# EAGLE schematic DIN41612_Backplane (EAGLE 9.6.2)

## Sheet 1 of 2
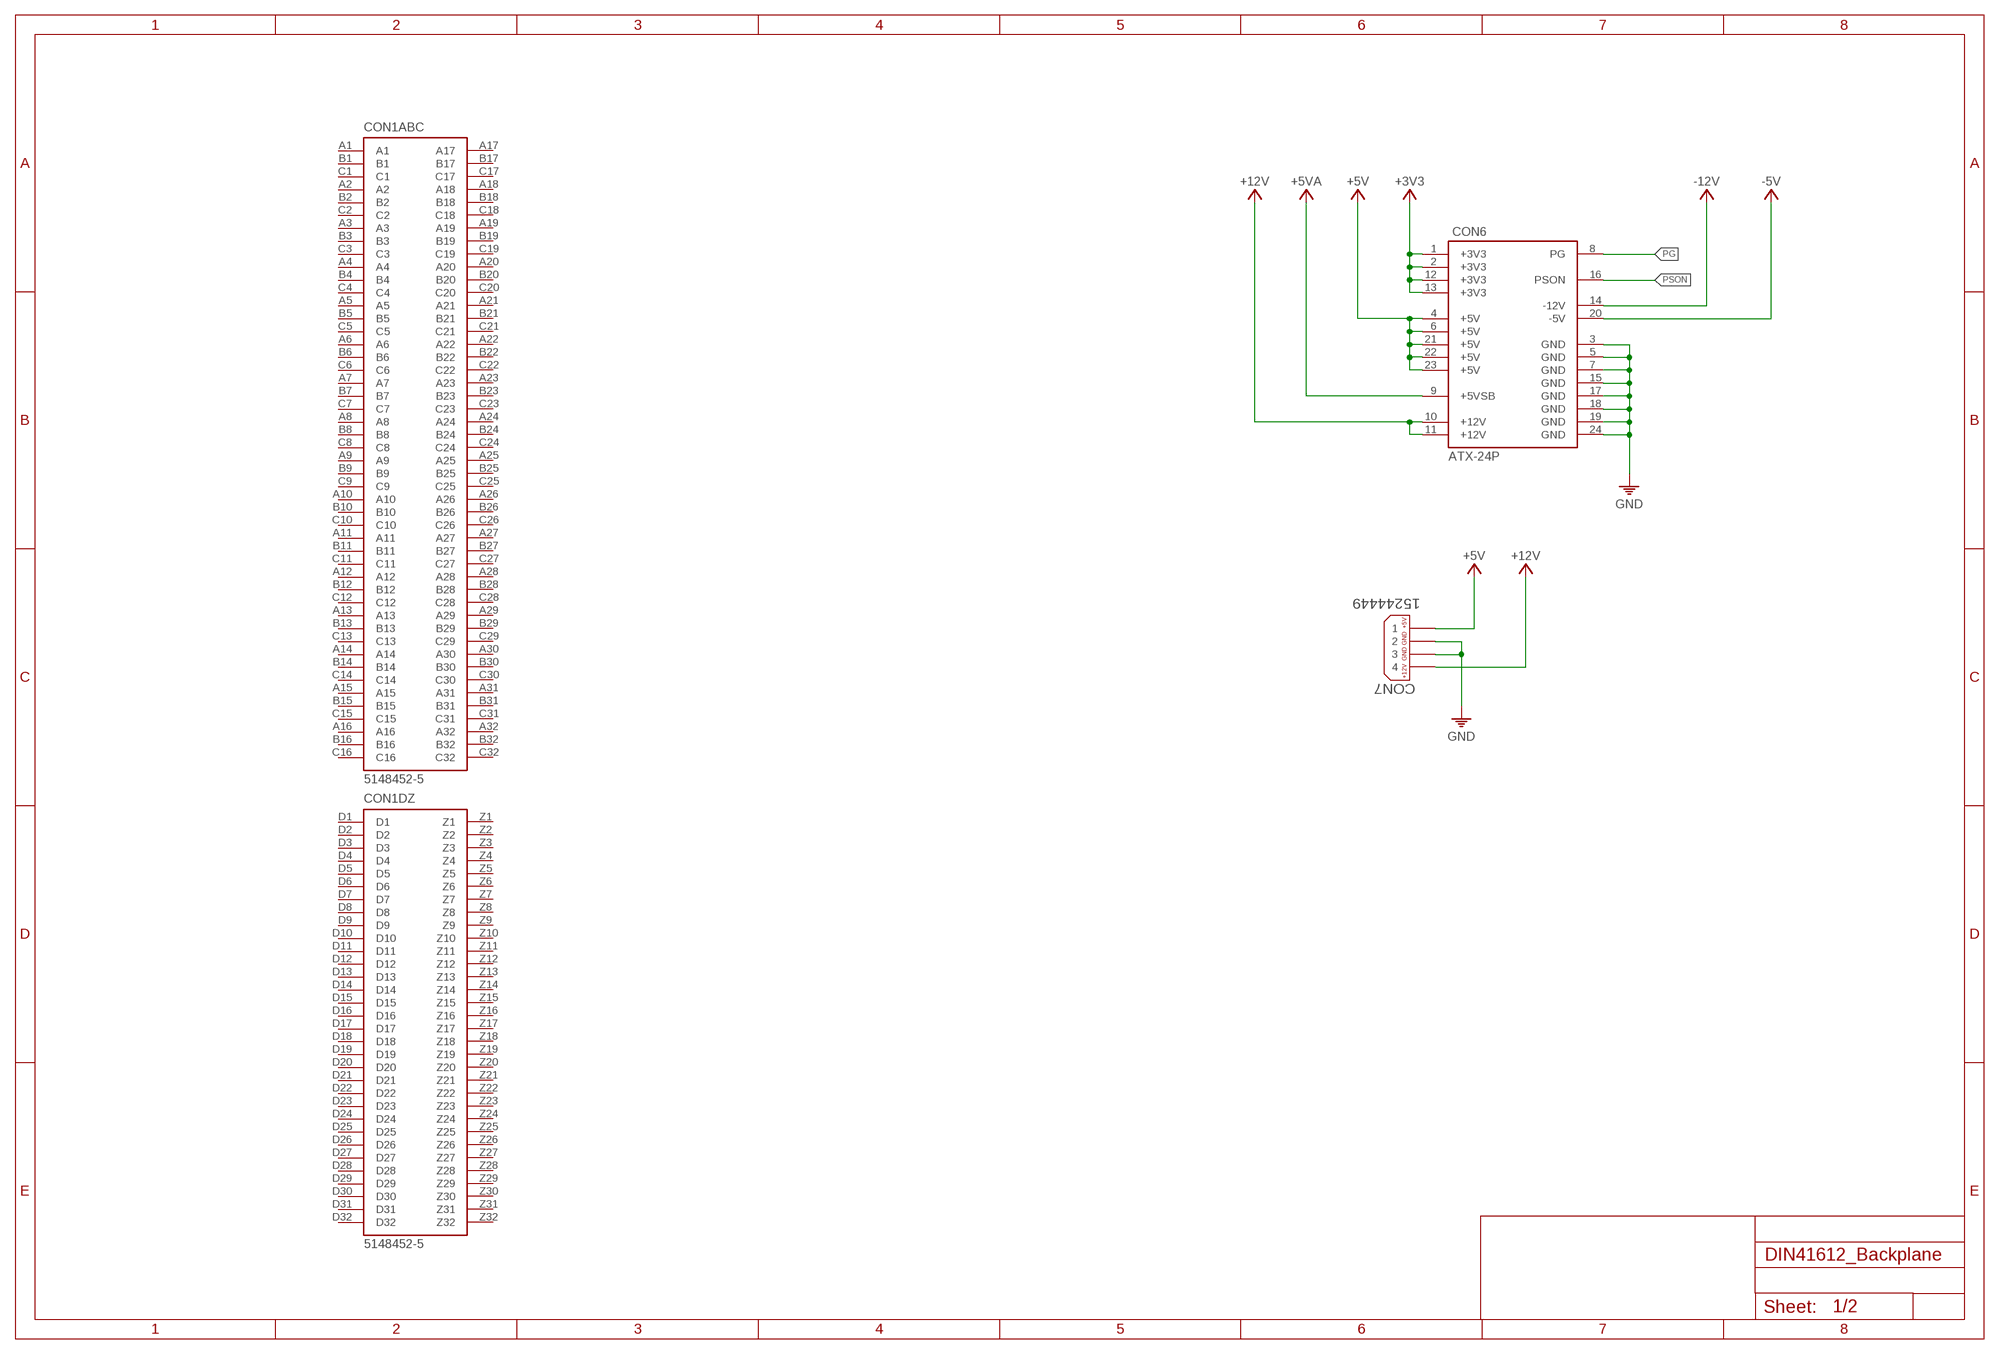
[diagram p0: schematic, sheet 1]

### Parts
CON1  5148452-5  DIN41612-160P-5148452-5  [DIN41612-160P]
CON6  ATX-24P  [ATX-24P]
CON7  15244449  [15244449]

### Nets
+3V3: CON6.1(+3V3) CON6.2(+3V3) CON6.12(+3V3) CON6.13(+3V3)
+5V: CON6.4(+5V) CON6.6(+5V) CON6.21(+5V) CON6.22(+5V) CON6.23(+5V) CON7.1
+5VA: CON6.9(+5VSB)
+12V: CON6.10(+12V) CON6.11(+12V) CON7.4
-5V: CON6.20(-5V)
-12V: CON6.14(-12V)
GND: CON6.3(GND) CON6.5(GND) CON6.7(GND) CON6.15(GND) CON6.17(GND) CON6.18(GND) CON6.19(GND) CON6.24(GND) CON7.2 CON7.3
PG: CON6.8(PG)
PSON: CON6.16(PSON)
Unconnected: CON1.A1(ABC:A1) CON1.A2(ABC:A2) CON1.A3(ABC:A3) CON1.A4(ABC:A4) CON1.A5(ABC:A5) CON1.A6(ABC:A6) CON1.A7(ABC:A7) CON1.A8(ABC:A8) CON1.A9(ABC:A9) CON1.A10(ABC:A10) CON1.A11(ABC:A11) CON1.A12(ABC:A12) CON1.A13(ABC:A13) CON1.A14(ABC:A14) CON1.A15(ABC:A15) CON1.A16(ABC:A16) CON1.A17(ABC:A17) CON1.A18(ABC:A18) CON1.A19(ABC:A19) CON1.A20(ABC:A20) CON1.A21(ABC:A21) CON1.A22(ABC:A22) CON1.A23(ABC:A23) CON1.A24(ABC:A24) CON1.A25(ABC:A25) CON1.A26(ABC:A26) CON1.A27(ABC:A27) CON1.A28(ABC:A28) CON1.A29(ABC:A29) CON1.A30(ABC:A30) CON1.A31(ABC:A31) CON1.A32(ABC:A32) CON1.B1(ABC:B1) CON1.B2(ABC:B2) CON1.B3(ABC:B3) CON1.B4(ABC:B4) CON1.B5(ABC:B5) CON1.B6(ABC:B6) CON1.B7(ABC:B7) CON1.B8(ABC:B8) CON1.B9(ABC:B9) CON1.B10(ABC:B10) CON1.B11(ABC:B11) CON1.B12(ABC:B12) CON1.B13(ABC:B13) CON1.B14(ABC:B14) CON1.B15(ABC:B15) CON1.B16(ABC:B16) CON1.B17(ABC:B17) CON1.B18(ABC:B18) CON1.B19(ABC:B19) CON1.B20(ABC:B20) CON1.B21(ABC:B21) CON1.B22(ABC:B22) CON1.B23(ABC:B23) CON1.B24(ABC:B24) CON1.B25(ABC:B25) CON1.B26(ABC:B26) CON1.B27(ABC:B27) CON1.B28(ABC:B28) CON1.B29(ABC:B29) CON1.B30(ABC:B30) CON1.B31(ABC:B31) CON1.B32(ABC:B32) CON1.C1(ABC:C1) CON1.C2(ABC:C2) CON1.C3(ABC:C3) CON1.C4(ABC:C4) CON1.C5(ABC:C5) CON1.C6(ABC:C6) CON1.C7(ABC:C7) CON1.C8(ABC:C8) CON1.C9(ABC:C9) CON1.C10(ABC:C10) CON1.C11(ABC:C11) CON1.C12(ABC:C12) CON1.C13(ABC:C13) CON1.C14(ABC:C14) CON1.C15(ABC:C15) CON1.C16(ABC:C16) CON1.C17(ABC:C17) CON1.C18(ABC:C18) CON1.C19(ABC:C19) CON1.C20(ABC:C20) CON1.C21(ABC:C21) CON1.C22(ABC:C22) CON1.C23(ABC:C23) CON1.C24(ABC:C24) CON1.C25(ABC:C25) CON1.C26(ABC:C26) CON1.C27(ABC:C27) CON1.C28(ABC:C28) CON1.C29(ABC:C29) CON1.C30(ABC:C30) CON1.C31(ABC:C31) CON1.C32(ABC:C32) CON1.D1(DZ:D1) CON1.D2(DZ:D2) CON1.D3(DZ:D3) CON1.D4(DZ:D4) CON1.D5(DZ:D5) CON1.D6(DZ:D6) CON1.D7(DZ:D7) CON1.D8(DZ:D8) CON1.D9(DZ:D9) CON1.D10(DZ:D10) CON1.D11(DZ:D11) CON1.D12(DZ:D12) CON1.D13(DZ:D13) CON1.D14(DZ:D14) CON1.D15(DZ:D15) CON1.D16(DZ:D16) CON1.D17(DZ:D17) CON1.D18(DZ:D18) CON1.D19(DZ:D19) CON1.D20(DZ:D20) CON1.D21(DZ:D21) CON1.D22(DZ:D22) CON1.D23(DZ:D23) CON1.D24(DZ:D24) CON1.D25(DZ:D25) CON1.D26(DZ:D26) CON1.D27(DZ:D27) CON1.D28(DZ:D28) CON1.D29(DZ:D29) CON1.D30(DZ:D30) CON1.D31(DZ:D31) CON1.D32(DZ:D32) CON1.Z1(DZ:Z1) CON1.Z2(DZ:Z2) CON1.Z3(DZ:Z3) CON1.Z4(DZ:Z4) CON1.Z5(DZ:Z5) CON1.Z6(DZ:Z6) CON1.Z7(DZ:Z7) CON1.Z8(DZ:Z8) CON1.Z9(DZ:Z9) CON1.Z10(DZ:Z10) CON1.Z11(DZ:Z11) CON1.Z12(DZ:Z12) CON1.Z13(DZ:Z13) CON1.Z14(DZ:Z14) CON1.Z15(DZ:Z15) CON1.Z16(DZ:Z16) CON1.Z17(DZ:Z17) CON1.Z18(DZ:Z18) CON1.Z19(DZ:Z19) CON1.Z20(DZ:Z20) CON1.Z21(DZ:Z21) CON1.Z22(DZ:Z22) CON1.Z23(DZ:Z23) CON1.Z24(DZ:Z24) CON1.Z25(DZ:Z25) CON1.Z26(DZ:Z26) CON1.Z27(DZ:Z27) CON1.Z28(DZ:Z28) CON1.Z29(DZ:Z29) CON1.Z30(DZ:Z30) CON1.Z31(DZ:Z31) CON1.Z32(DZ:Z32)

## Sheet 2 of 2
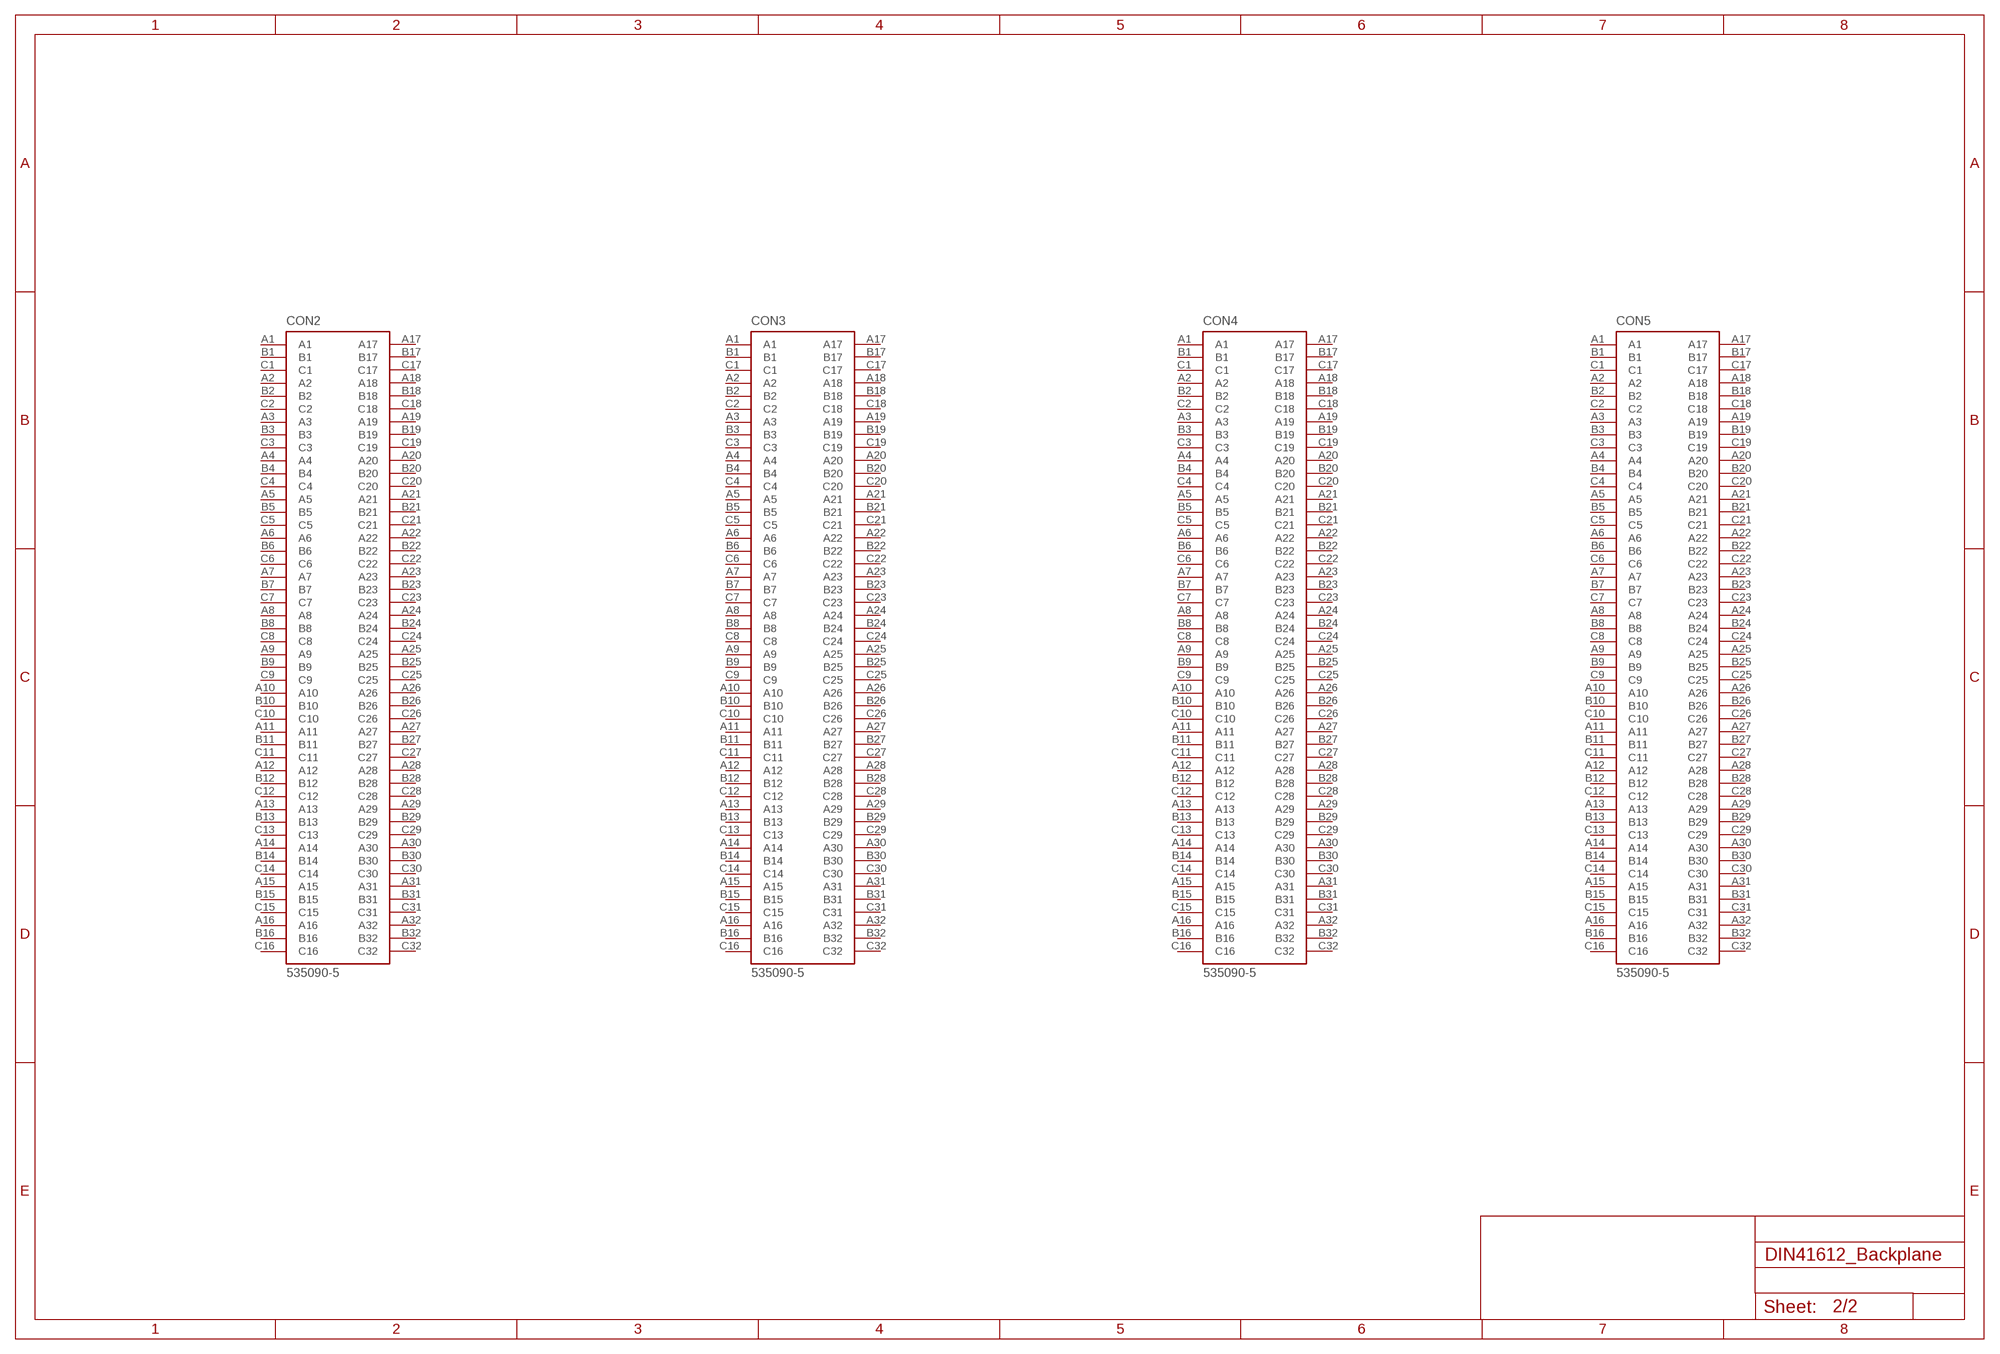
[diagram p1: schematic, sheet 2]

### Parts
CON2  535090-5  DIN41612-96P-535090-5  [DIN41612-96P]
CON3  535090-5  DIN41612-96P-535090-5  [DIN41612-96P]
CON4  535090-5  DIN41612-96P-535090-5  [DIN41612-96P]
CON5  535090-5  DIN41612-96P-535090-5  [DIN41612-96P]
Unconnected: CON2.A1 CON2.A2 CON2.A3 CON2.A4 CON2.A5 CON2.A6 CON2.A7 CON2.A8 CON2.A9 CON2.A10 CON2.A11 CON2.A12 CON2.A13 CON2.A14 CON2.A15 CON2.A16 CON2.A17 CON2.A18 CON2.A19 CON2.A20 CON2.A21 CON2.A22 CON2.A23 CON2.A24 CON2.A25 CON2.A26 CON2.A27 CON2.A28 CON2.A29 CON2.A30 CON2.A31 CON2.A32 CON2.B1 CON2.B2 CON2.B3 CON2.B4 CON2.B5 CON2.B6 CON2.B7 CON2.B8 CON2.B9 CON2.B10 CON2.B11 CON2.B12 CON2.B13 CON2.B14 CON2.B15 CON2.B16 CON2.B17 CON2.B18 CON2.B19 CON2.B20 CON2.B21 CON2.B22 CON2.B23 CON2.B24 CON2.B25 CON2.B26 CON2.B27 CON2.B28 CON2.B29 CON2.B30 CON2.B31 CON2.B32 CON2.C1 CON2.C2 CON2.C3 CON2.C4 CON2.C5 CON2.C6 CON2.C7 CON2.C8 CON2.C9 CON2.C10 CON2.C11 CON2.C12 CON2.C13 CON2.C14 CON2.C15 CON2.C16 CON2.C17 CON2.C18 CON2.C19 CON2.C20 CON2.C21 CON2.C22 CON2.C23 CON2.C24 CON2.C25 CON2.C26 CON2.C27 CON2.C28 CON2.C29 CON2.C30 CON2.C31 CON2.C32 CON3.A1 CON3.A2 CON3.A3 CON3.A4 CON3.A5 CON3.A6 CON3.A7 CON3.A8 CON3.A9 CON3.A10 CON3.A11 CON3.A12 CON3.A13 CON3.A14 CON3.A15 CON3.A16 CON3.A17 CON3.A18 CON3.A19 CON3.A20 CON3.A21 CON3.A22 CON3.A23 CON3.A24 CON3.A25 CON3.A26 CON3.A27 CON3.A28 CON3.A29 CON3.A30 CON3.A31 CON3.A32 CON3.B1 CON3.B2 CON3.B3 CON3.B4 CON3.B5 CON3.B6 CON3.B7 CON3.B8 CON3.B9 CON3.B10 CON3.B11 CON3.B12 CON3.B13 CON3.B14 CON3.B15 CON3.B16 CON3.B17 CON3.B18 CON3.B19 CON3.B20 CON3.B21 CON3.B22 CON3.B23 CON3.B24 CON3.B25 CON3.B26 CON3.B27 CON3.B28 CON3.B29 CON3.B30 CON3.B31 CON3.B32 CON3.C1 CON3.C2 CON3.C3 CON3.C4 CON3.C5 CON3.C6 CON3.C7 CON3.C8 CON3.C9 CON3.C10 CON3.C11 CON3.C12 CON3.C13 CON3.C14 CON3.C15 CON3.C16 CON3.C17 CON3.C18 CON3.C19 CON3.C20 CON3.C21 CON3.C22 CON3.C23 CON3.C24 CON3.C25 CON3.C26 CON3.C27 CON3.C28 CON3.C29 CON3.C30 CON3.C31 CON3.C32 CON4.A1 CON4.A2 CON4.A3 CON4.A4 CON4.A5 CON4.A6 CON4.A7 CON4.A8 CON4.A9 CON4.A10 CON4.A11 CON4.A12 CON4.A13 CON4.A14 CON4.A15 CON4.A16 CON4.A17 CON4.A18 CON4.A19 CON4.A20 CON4.A21 CON4.A22 CON4.A23 CON4.A24 CON4.A25 CON4.A26 CON4.A27 CON4.A28 CON4.A29 CON4.A30 CON4.A31 CON4.A32 CON4.B1 CON4.B2 CON4.B3 CON4.B4 CON4.B5 CON4.B6 CON4.B7 CON4.B8 CON4.B9 CON4.B10 CON4.B11 CON4.B12 CON4.B13 CON4.B14 CON4.B15 CON4.B16 CON4.B17 CON4.B18 CON4.B19 CON4.B20 CON4.B21 CON4.B22 CON4.B23 CON4.B24 CON4.B25 CON4.B26 CON4.B27 CON4.B28 CON4.B29 CON4.B30 CON4.B31 CON4.B32 CON4.C1 CON4.C2 CON4.C3 CON4.C4 CON4.C5 CON4.C6 CON4.C7 CON4.C8 CON4.C9 CON4.C10 CON4.C11 CON4.C12 CON4.C13 CON4.C14 CON4.C15 CON4.C16 CON4.C17 CON4.C18 CON4.C19 CON4.C20 CON4.C21 CON4.C22 CON4.C23 CON4.C24 CON4.C25 CON4.C26 CON4.C27 CON4.C28 CON4.C29 CON4.C30 CON4.C31 CON4.C32 CON5.A1 CON5.A2 CON5.A3 CON5.A4 CON5.A5 CON5.A6 CON5.A7 CON5.A8 CON5.A9 CON5.A10 CON5.A11 CON5.A12 CON5.A13 CON5.A14 CON5.A15 CON5.A16 CON5.A17 CON5.A18 CON5.A19 CON5.A20 CON5.A21 CON5.A22 CON5.A23 CON5.A24 CON5.A25 CON5.A26 CON5.A27 CON5.A28 CON5.A29 CON5.A30 CON5.A31 CON5.A32 CON5.B1 CON5.B2 CON5.B3 CON5.B4 CON5.B5 CON5.B6 CON5.B7 CON5.B8 CON5.B9 CON5.B10 CON5.B11 CON5.B12 CON5.B13 CON5.B14 CON5.B15 CON5.B16 CON5.B17 CON5.B18 CON5.B19 CON5.B20 CON5.B21 CON5.B22 CON5.B23 CON5.B24 CON5.B25 CON5.B26 CON5.B27 CON5.B28 CON5.B29 CON5.B30 CON5.B31 CON5.B32 CON5.C1 CON5.C2 CON5.C3 CON5.C4 CON5.C5 CON5.C6 CON5.C7 CON5.C8 CON5.C9 CON5.C10 CON5.C11 CON5.C12 CON5.C13 CON5.C14 CON5.C15 CON5.C16 CON5.C17 CON5.C18 CON5.C19 CON5.C20 CON5.C21 CON5.C22 CON5.C23 CON5.C24 CON5.C25 CON5.C26 CON5.C27 CON5.C28 CON5.C29 CON5.C30 CON5.C31 CON5.C32

## Library data of the parts
CON1 = ds_con:DIN41612-160P: Receptacle, Board-to-Board, 160 Position, 2.54 mm [.1 in] Centerline, Printed Circuit Board, 5 Row, Vertical, Eurocard Type L, Eurocard Connectors
CON2-CON5 = ds_con:DIN41612-96P
CON6 = ds_con:ATX-24P
CON7 = ds_con:15244449: Connector Header Through Hole 4 position 0.200" (5.08mm)